# EAGLE board ccnor_stm32_v24-sync-unified-ss (EAGLE 6.1)
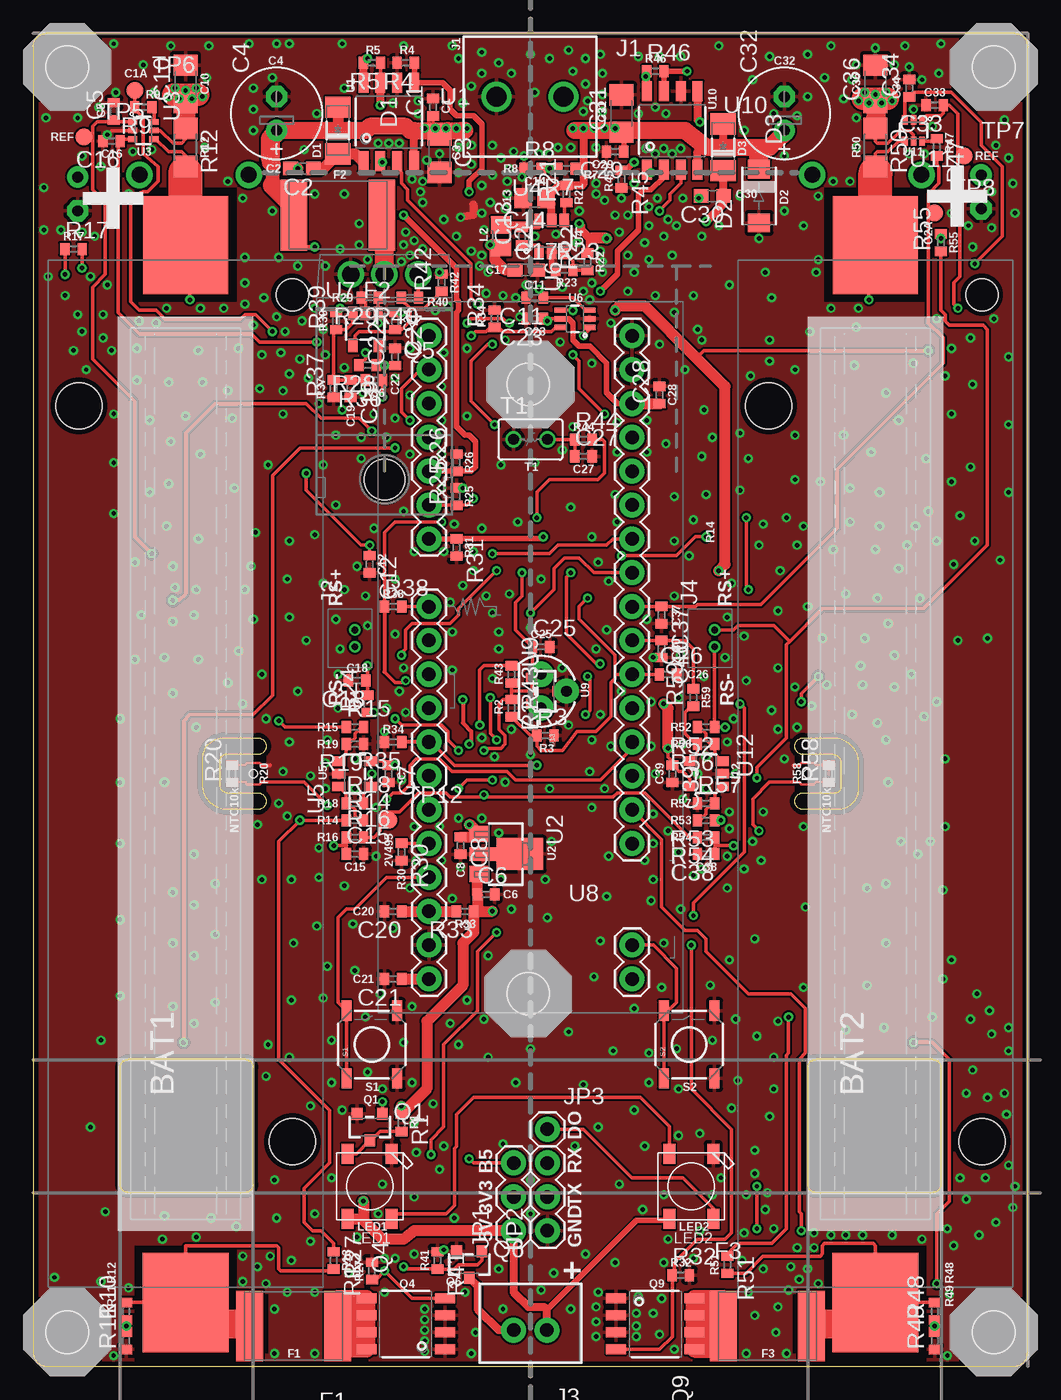
[diagram p2: board, top side]
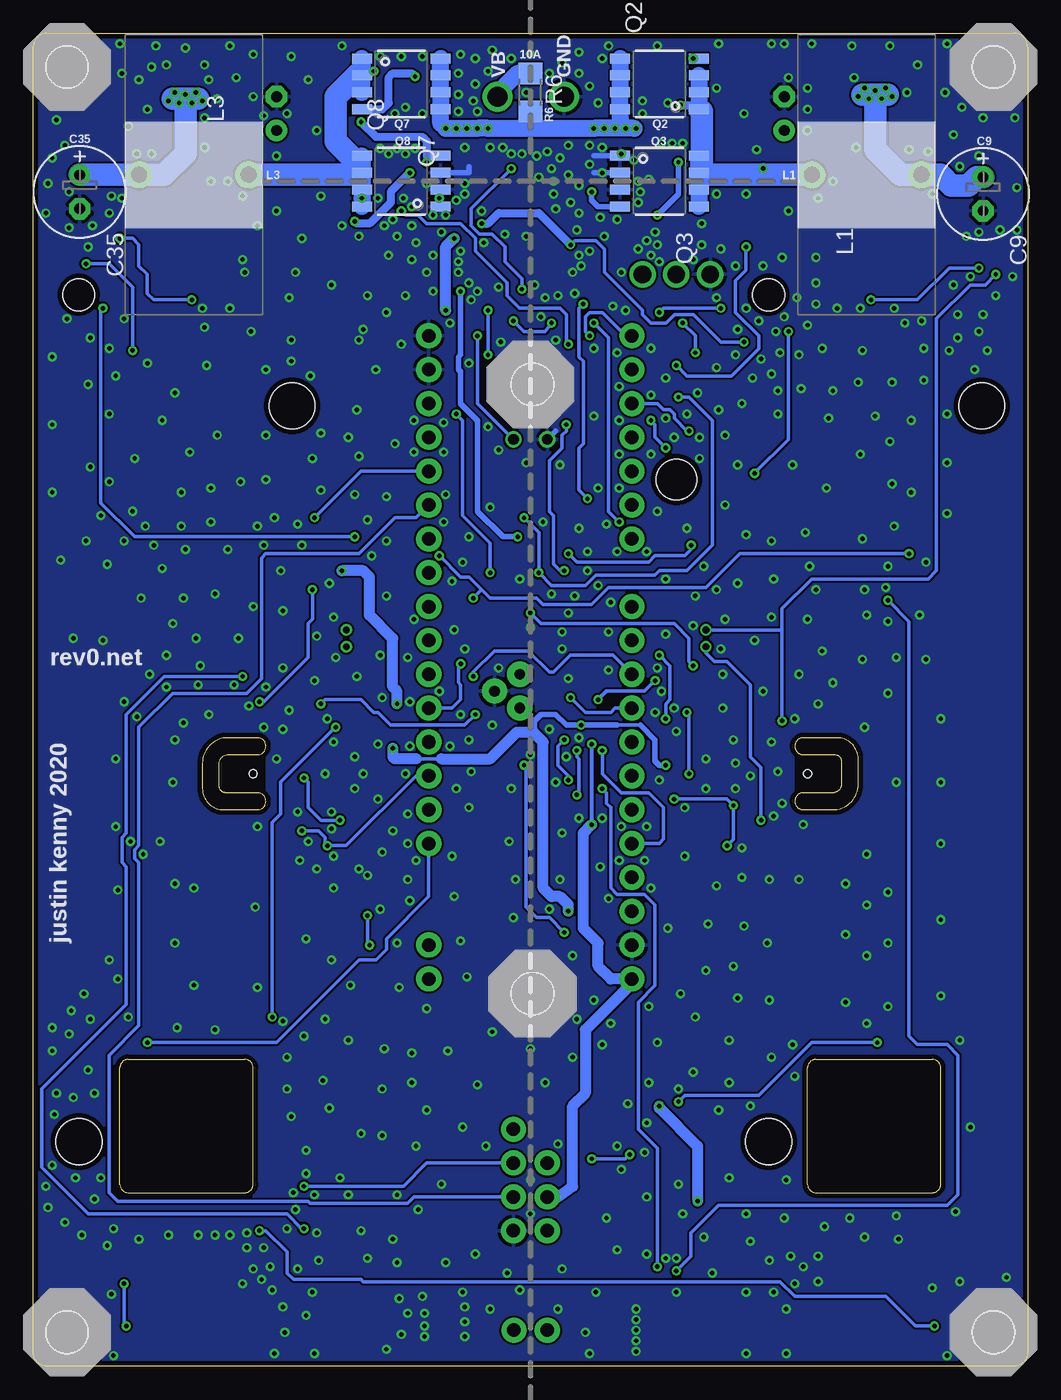
[diagram p3: board, bottom side, seen from below]

Size 74.6 x 100 mm. Coordinates in mm from the lower left corner, seen from the top.
Outline: 1,0 73.6,0 arc90 74.6,1 74.6,99 arc90 73.6,100 1,100 arc90 0,99 0,1 arc90 1,0
Outline: 57.78,43.02 60.17,43.02 arc90 60.64,43.5 60.64,45.24 arc90 60.01,45.88 57.78,45.88 arc-180 57.78,47.15 60.01,47.15 arc-90 61.91,45.24 61.91,43.34 arc-90 60.33,41.75 57.78,41.75 arc-180 57.78,43.02
Outline: 16.83,45.88 14.45,45.88 arc90 13.97,45.4 13.97,43.66 arc90 14.61,43.02 16.83,43.02 arc-180 16.83,41.75 14.61,41.75 arc-90 12.7,43.66 12.7,45.56 arc-90 14.29,47.15 16.83,47.15 arc-180 16.83,45.88
Outline: 6.51,13.65 6.51,22.38 arc-90 7.14,23.02 15.88,23.02 arc-90 16.51,22.38 16.51,13.65 arc-90 15.88,13.02 7.14,13.02 arc-90 6.51,13.65
Outline: 58.1,13.65 58.1,22.38 arc-90 58.74,23.02 67.47,23.02 arc-90 68.1,22.38 68.1,13.65 arc-90 67.47,13.02 58.74,13.02 arc-90 58.1,13.65
Copper layers (1*16): Top 0.0356mm / dielectric 1.5011mm / Bottom 0.0356mm
Design rules: minimum track width 6mil, minimum drill 13mil, track to track 6mil, track to pad 6mil, pad to pad 6mil, via to via 6mil, smd to smd 6mil, copper to edge 15mil, drill to drill 6mil, minimum pad ring 7mil, minimum via ring 7mil, stop-mask expansion 2.5mil, vias tented up to drill 14mil, thermal gap 10mil
Holes 3.17 mm at 2.54,2.54 72.07,2.54 72.07,97.47 37.15,73.66 37.15,27.94 2.54,97.47
Holes 3.05 mm at 26.35,66.52
Holes 0.6 mm at 16.51,44.45 58.1,44.45
tRestrict: area -0.6,94.3 to 5.7,100.6; area 68.9,94.3 to 75.2,100.6; area -0.6,-0.6 to 5.7,5.7; area 68.9,-0.6 to 75.2,5.7; area 34,24.8 to 40.3,31.1; area 34.1,70.5 to 40.5,76.8; area 57.1,42.5 to 59.1,46.4; area 14,43 to 17.5,45.7; area 59.4,0.5 to 67,9; area 57,1 to 59.4,5.4; area 7.6,0.5 to 15.2,9; area 15.2,1 to 17.6,5.4; 2 more areas
bRestrict: area 57.1,42.5 to 61,46.4; area 14,42.5 to 17.5,46.4; area -0.6,-0.6 to 5.7,5.7; area 68.9,-0.6 to 75.2,5.7; area 68.9,94.3 to 75.2,100.6; area -0.6,94.3 to 5.7,100.6; area 34.1,70.5 to 40.5,76.8; area 34,24.8 to 40.3,31.1

## Footprints (pad centres in the part's own frame; a part is rotated, then mirrored left to right if it is on the bottom)
1S_18650_SMD_NH = smd 7.341 x 6.35: 1+ 39.67,0 | smd 7.46 x 6.47: 1- -39.67,0 | hole 3.454: -27.6,-8; 27.6,8 | hole 2.39: 35.93,-8
C0402 = smd 0.7 x 0.9: 1 -0.65,0; 2 0.65,0
C0603 = smd 1.1 x 1: 1 -0.85,0; 2 0.85,0
C1206 = smd 1.6 x 1.8: 1 -1.4,0; 2 1.4,0
E2,5-7 = drill 0.813 pad 1.6: + -1.27,0 | drill 0.813 pad 1.6 octagon: - 1.27,0
C0805 = smd 1.3 x 1.5: 1 -0.85,0; 2 0.85,0
SOD123 = smd 1.6 x 1.9: A -1.75,0; K 1.75,0
SMA = smd 1.4 x 1.64: A -2.015,0; K 2.015,0
2920 = smd 2 x 5.3: A -3.3,0; K 3.3,0
PHOENIXCONTACT1935161 = drill 1.5: 1 0,0; 2 5,0
M02_1P25MM = drill 0.5: 1 -0.625,0; 2 0.625,0
B2B-XH-A = drill 1.016 pad 1.88: 1 -2.5,0; 2 0,0
1X03 = drill 1.016 pad 1.88: 1 0,0; 2 2.54,0; 3 5.08,0
1X01 = drill 1.016 pad 1.88: 1 0,0
INDUCTOR_10A_8.2MMX21MM = drill 1.2 pad 2: P$1 0,4.1; P$2 0,-4.1
0805 = smd 1.3 x 1.5: 1 -0.85,0; 2 0.85,0
WS2812B = smd 1.5 x 0.9: 1-VDD 2.45,-1.65; 2-DOUT 2.45,1.65; 3-GND -2.45,1.65; 4-DIN -2.45,-1.65
SOT23 = smd 0.8 x 0.9: 1 0.95,1; 2 -0.95,1; 3 0,-1
8-SOIC = smd 0.75 x 1.5: 1 -1.905,-2.95; 2 -0.635,-2.95; 3 0.635,-2.95; 4 1.905,-2.95; 5 1.905,2.95; 6 0.635,2.95; 7 -0.635,2.95; 8 -1.905,2.95
TO-220 = drill 1.325: 1 -2.54,0; 2 0,0; 3 2.54,0
R0402 = smd 0.7 x 0.9: 1 -0.65,0; 2 0.65,0
R1206 = smd 1.6 x 1.803: 1 -1.422,0; 2 1.422,0
TACTILE_SWITCH_SMD = smd 1.524 x 0.762: 1 -2.54,1.905; 2 2.54,1.905; 3 -2.54,-1.905; 4 2.54,-1.905
THERMISTOR_3MMX3MM = drill 0.813: 1 -1.27,0; 2 1.27,0
TPAD_MED_ROUND = smd 1.27 x 1.27: 1 0,0
SOT-89 = smd 1.2 x 1.5: 1 -1.5,0; 3 1.5,0 | smd 1 x 2: 2 0,0.25 | smd 2.4 x 3.5: 2@1 0,3
SOT-363 = smd 0.42 x 0.7: 1 -0.65,-0.8; 2 0,-0.8; 3 0.65,-0.8; 4 0.65,0.8; 5 0,0.8; 6 -0.65,0.8
SOT23-6 = smd 0.7 x 1: 1 -0.95,-1.2; 2 0,-1.2; 3 0.95,-1.2; 4 0.95,1.2; 5 0,1.2; 6 -0.95,1.2
SOT23-5 = smd 0.7 x 1: 1 0.95,1.2; 2 0,1.2; 3 -0.95,1.2; 4 -0.95,-1.2; 5 0.95,-1.2
SC70-6 = smd 0.4 x 0.9: 1 -0.65,-1.1; 2 0,-1.1; 3 0.65,-1.1; 4 0.65,1.1; 5 0,1.1; 6 -0.65,1.1
STM32_BLUE_PILL_USABLE = drill 1.016 pad 1.88: 3V3 -7.62,-19.05; 3V3_2 7.62,24.13; 5V 7.62,19.05; A0 -7.62,13.97; A1 -7.62,11.43; A2 -7.62,8.89; A3 -7.62,6.35; A4 -7.62,3.81; A5 -7.62,1.27; A6 -7.62,-1.27; A7 -7.62,-3.81; A8 7.62,-13.97; A9 7.62,-11.43; A10 7.62,-8.89; A12 7.62,-3.81; A15 7.62,-1.27; B0 -7.62,-6.35; B1 -7.62,-8.89; B3 7.62,1.27; B4 7.62,3.81; B5 7.62,6.35; B6 7.62,8.89; B7 7.62,11.43; B8 7.62,13.97; B9 7.62,16.51; B10 -7.62,-11.43; B11 -7.62,-13.97; B12 7.62,-24.13; B13 7.62,-21.59; B14 7.62,-19.05; B15 7.62,-16.51; C13 -7.62,21.59; GND -7.62,-24.13; GND2 -7.62,-21.59; GND4 7.62,21.59; RST -7.62,-16.51; VBAT -7.62,24.13
TO-92 = drill 0.813 pad 1.88: 1 -1.27,0; 2 0,1.905; 3 1.27,0

## Placement (x,y rotation side)
BAT1  1_18650_HOLDER  [1S_18650_SMD_NH]  11.43,44.45 90 top
BAT2  1_18650_HOLDER  [1S_18650_SMD_NH]  63.18,44.45 90 top
C1  1u  [C0402]  30,94.46 90 top
C2  1u  [C0603]  20.16,89.85 180 top
C3  10u  [C1206]  30.48,90.96 270 top
C4  470u  [E2,5-7]  18.26,93.98 90 top
C5  1u  [C0402]  6.03,94.14 90 top
C6  1u  [C0402]  33.97,35.4 0 top
C7  1u  [C0402]  26.67,44.45 270 top
C8  1u  [C0402]  32.07,39.05 270 top
C9  470u  [E2,5-7]  3.33,87.95 270 bottom
C10  10u  [C1206]  11.43,96.2 90 top
C11  1u  [C0402]  37.62,80.17 180 top
C12  100n  [C0402]  25.24,60.17 270 top
C13  100n  [C0402]  36.67,84.77 90 top
C14  22u  [C0805]  37.62,87.63 180 top
C15  1u  [C0402]  24.13,38.42 0 top
C16  1u  [C0402]  5.87,91.92 180 top
C17  22u  [C0603]  36.99,82.23 0 top
C18  100n  [C0402]  24.29,51.44 180 top
C19  100n  [C0402]  23.81,73.34 270 top
C20  1u  [C0402]  26.99,34.13 180 top
C21  1u  [C0402]  26.99,29.05 180 top
C22  1u  [C0402]  27.15,75.72 90 top
C23  1u  [C0402]  37.62,78.58 180 top
C24  DNI  [C0402]  27.15,78.42 270 top
C25  1u  [C0402]  38.1,53.98 0 top
C26  4.7u  [C0402]  47.62,51.91 0 top
C27  1u  [C0402]  41.27,68.26 0 top
C28  1u  [C0402]  46.99,72.87 90 top
C29  1u  [C0402]  43.66,91.12 180 top
C30  1u  [C0603]  50.96,87.79 180 top
C31  10u  [C1206]  44.13,93.98 90 top
C32  470u  [E2,5-7]  56.36,93.98 90 top
C33  1u  [C0402]  67.63,94.61 180 top
C34  1u  [C0402]  65.72,95.89 90 top
C35  470u  [E2,5-7]  71.12,88.11 270 bottom
C36  10u  [C1206]  63.18,96.2 90 top
C37  100n  [C0402]  47.15,56.36 270 top
C38  1u  [C0402]  50.48,38.42 180 top
C39  1u  [C0402]  47.94,44.45 270 top
C40  100n  [C0402]  47.15,53.82 270 top
D1  SS16F  [SOD123]  22.86,92.71 270 top
D2  SS54  [SMA]  54.45,87.79 90 top
D3  SS16F  [SOD123]  51.75,91.44 270 top
F1  PTC2920  [2920]  19.53,3.02 180 top
F2  PTC2920  [2920]  22.86,86.36 180 top
F3  PTC2920  [2920]  55.09,3.02 0 top
J1  M02PT  [PHOENIXCONTACT1935161]  34.77,95.25 0 top
J2  M021P25  [M02_1P25MM]  24.13,54.61 90 top
J3  M02XH  [B2B-XH-A]  36.04,2.7 180 top
J4  M021P25  [M02_1P25MM]  51.12,54.61 90 top
JP1  [1X03]  36.04,10.16 90 top
JP2  [1X03]  38.58,10.16 90 top
JP3  M01PTH  [1X01]  38.58,17.78 0 top
L1  60u  [INDUCTOR_10A_8.2MMX21MM]  12.06,89.38 90 bottom
L2  4.7u  [0805]  35.08,84.77 270 top
L3  60u  [INDUCTOR_10A_8.2MMX21MM]  62.55,89.38 270 bottom
LED1  WS2812B  [WS2812B]  25.24,13.49 270 top
LED2  WS2812B  [WS2812B]  49.37,13.49 270 top
Q1  2N7002P  [SOT23]  25.24,17.94 0 top
Q2  WSP4406  [8-SOIC]  27.62,96.2 90 bottom
Q3  WSP4406  [8-SOIC]  27.62,88.9 270 bottom
Q4  NCE3018AS  [8-SOIC]  27.94,3.17 90 top
Q5  IRLB8314PBF  [TO-220]  26.35,81.92 180 top
Q6  2302  [SOT23]  32.7,7.62 0 top
Q7  WSP4406  [8-SOIC]  46.99,96.2 270 bottom
Q8  WSP4406  [8-SOIC]  46.99,88.9 90 bottom
Q9  NCE3018AS  [8-SOIC]  46.67,3.17 270 top
R1  680  [R0402]  27.62,18.26 270 top
R2  820  [R0402]  35.88,49.37 270 top
R3  1.6k  [R0402]  38.42,47.31 0 top
R4  10k  [R0402]  27.94,97.79 180 top
R5  10k  [R0402]  25.4,97.79 180 top
R6  5A  [R1206]  37.31,95.57 270 bottom
R7  30k  [R0402]  40.01,89.85 180 top
R8  10k  [R0402]  37.47,89.85 0 top
R9  1.6k  [R0402]  8.26,94.46 180 top
R10  10k  [R0402]  6.99,4.13 90 top
R11  10k  [R0402]  6.99,1.91 90 top
R12  5m  [R1206]  11.43,91.44 270 top
R13  100  [R0402]  22.54,7.94 270 top
R14  220k  [R0402]  24.13,40.96 0 top
R15  220k  [R0402]  24.13,47.94 0 top
R16  10k  [R0402]  24.13,39.69 0 top
R17  100  [R0402]  3.02,83.82 0 top
R18  150k  [R0402]  24.13,42.23 0 top
R19  150k  [R0402]  24.13,46.67 180 top
R20  NTC 10k  [R0402]  14.92,44.45 90 top
R21  150k  [R0402]  40.01,87.95 90 top
R22  51k  [R0402]  41.59,82.87 90 top
R23  10k  [R0402]  39.85,82.23 0 top
R24  1.6k  [R0402]  25.08,49.69 90 top
R25  10k  [R0402]  31.75,65.25 90 top
R26  10k  [R0402]  31.75,67.79 90 top
R27  10k  [R0402]  25.4,7.14 90 top
R28  68k  [R0402]  25.08,75.09 180 top
R29  13k  [R0402]  25.24,80.17 180 top
R30  10k  [R0402]  27.62,38.58 270 top
R31  10k  [R0402]  31.75,61.44 270 top
R32  10k  [R0402]  48.58,6.83 0 top
R33  10  [R0402]  32.38,34.13 180 top
R34  10k  [R0402]  34.61,78.58 90 top
R35  10k  [R0402]  26.99,46.83 180 top
R36  2.4k  [R0402]  25.56,73.98 180 top
R37  10k  [R0402]  22.54,73.34 90 top
R38  1.6k  [R0402]  26.99,56.99 0 top
R39  DNI  [R0402]  22.7,78.42 90 top
R40  680  [R0402]  28.26,80.17 180 top
R41  10k  [R0402]  30.32,7.94 270 top
R42  DNI  [R0402]  30.64,81.28 90 top
R43  120  [R0402]  35.88,51.91 270 top
R44  10k  [R0402]  41.27,69.53 0 top
R45  10k  [R0402]  44.13,89.06 270 top
R46  10k  [R0402]  46.67,97.16 0 top
R47  1.6k  [R0402]  67.79,91.44 270 top
R48  10k  [R0402]  67.63,4.13 90 top
R49  10k  [R0402]  67.63,1.91 90 top
R50  5m  [R1206]  63.18,91.44 270 top
R51  100  [R0402]  52.07,7.62 270 top
R52  220k  [R0402]  50.48,47.94 180 top
R53  220k  [R0402]  50.48,40.96 180 top
R54  10k  [R0402]  50.48,39.69 180 top
R55  100  [R0402]  68.1,84.3 90 top
R56  150k  [R0402]  50.48,46.67 180 top
R57  150k  [R0402]  50.48,42.23 0 top
R58  NTC 10k  [R0402]  59.69,44.45 90 top
R59  1.6k  [R0402]  49.53,50.16 90 top
S1  [TACTILE_SWITCH_SMD]  25.4,24.13 90 top
S2  [TACTILE_SWITCH_SMD]  49.21,24.13 90 top
T1  NTC3MM  [THERMISTOR_3MMX3MM]  37.31,69.53 0 top
TP5  TPADMED_ROUND  [TPAD_MED_ROUND]  3.81,92.23 0 top
TP6  TPADMED_ROUND  [TPAD_MED_ROUND]  7.62,95.73 0 top
TP7  TPADMED_ROUND  [TPAD_MED_ROUND]  69.85,90.81 0 top
TP8  TPADMED_ROUND  [TPAD_MED_ROUND]  67.63,86.52 0 top
TP12  TPADMED_ROUND  [TPAD_MED_ROUND]  26.67,40.96 0 top
U1  ADP3110A  [8-SOIC]  26.67,93.34 0 top
U2  3.3V  [SOT-89]  33.5,38.42 270 top
U3  NCS199A1  [SOT-363]  8.26,92.71 270 top
U4  MP2359  [SOT23-6]  38.89,84.77 0 top
U5  MCP6001U  [SOT23-5]  24.13,44.45 90 top
U6  SN74LVC1G3157SC70-6  [SC70-6]  40.64,78.58 90 top
U7  LM321  [SOT23-5]  24.92,77.79 0 top
U8  STM32_BLUE_PILL  [STM32_BLUE_PILL_USABLE]  37.31,53.18 180 top
U9  TL431SOT23  [SOT23]  38.42,50.64 90 top
U10  ADP3110A  [8-SOIC]  47.94,92.71 0 top
U11  NCS199A1  [SOT-363]  66.04,92.71 180 top
U12  MCP6001U  [SOT23-5]  50.48,44.45 270 top
U13  TL431TO92  [TO-92]  38.1,50.64 270 top

## Tracks (layer width: path | path; a pad name or v marks a point on that pad's centre or on a via)
2V495  (via drill 0.33)
  Top 0.254: U9.1 37.42,51.79 | U9.2 37.47,49.64 37.47,49.58 37.42,49.53 | 35.88,50.64 R2.1 35.26,50.02 34.92,49.69 34.92,47.78 35.4,47.31 35.4,46.67 35.08,46.35 33.97,46.35 v33.81,46.2 | U9.1 37.42,50.64 | 37.42,50.64 U9.2 | U9.2 37.42,49.53 | 37.42,49.53 37.42,49.49 | R43.2 35.88,50.64 | 35.88,50.64 37.42,50.64 | R44.2 42.7,69.53 42.86,69.37 42.86,66.99 42.39,66.52 38.73,66.52 37.78,65.56 v37.78,63.66 | v36.67,59.53 36.67,57.78 36.2,57.31 36.2,55.23 C25.1 37.47,53.96 37.47,51.64 | R16.2 25.56,39.69 26.04,40.16 26.04,41.27 26.35,41.59 26.67,41.59 | 26.67,41.59 27.46,41.59 28.89,43.02 30.96,43.02 31.27,42.7 33.66,42.7 v33.81,42.86 33.97,42.7 43.5,42.7 43.81,43.02 45.88,43.02 49.21,39.69 R54.2 49.85,39.69 | R36.1 26.21,72.72 v26.19,72.71 | TP12.1 26.67,41.59 | U13.3 37.74,49.37 U9.2 | U13.1 37.74,51.91 37.47,51.64 | 37.47,51.64 U9.1
  Bottom 0.254: v37.78,63.66 36.67,62.55 v36.67,59.53 35.72,58.58 33.18,58.58 32.38,59.37 27.94,59.37 27.62,59.69 25.56,59.69 23.65,61.59 23.65,70.96 25.4,72.71 v26.19,72.71 | v33.81,42.86 33.66,43.18 33.66,45.56 33.81,45.72 v33.81,46.2
3V3  (via drill 0.33)
  Top 0.254: R38.1 26.34,62.53 27.15,63.34 v30.64,63.34 | v32.54,78.26 32.86,78.58 35.24,78.58 35.56,78.26 v35.72,78.26 | U6.5 38.73,78.58 v38.58,78.42 38.42,78.58 C23.1 | 26.34,52.09 27.15,51.28 27.78,51.28 v27.94,51.44
  Top 0.305: R38.1 26.34,52.09 | v32.23,50.01 32.23,48.26 32.86,47.62 32.86,46.83 v32.7,46.67
  Top 0.406: U6.5 40.16,78.58 40.48,78.26 40.48,76.99 40.96,76.52 41.75,76.52 43.02,75.25 43.02,73.03 43.81,72.23 U8.3V3
  Top 0.813: U8.3V3 C28.1 | C21.1 U8.3V3_2 | v32.7,40.64 32.77,40.64 U2.1 33.28,39.7 C8.1
  Bottom 0.254: v32.54,78.26 31.43,77.15 31.43,64.14 v30.64,63.34 | v35.72,78.26 36.2,77.63 37.78,77.63 v38.58,78.42 | 31.59,50.64 28.73,50.64 v27.94,51.44
  Bottom 0.305: 31.59,50.64 v32.23,50.01 | v32.7,46.67 v32.7,40.64
  Bottom 0.813: JP1.2 35.24,12.7 34.13,13.49 34.13,19.53 33.18,20.48 33.18,25.24 29.69,28.73 U8.3V3_2 31.27,29.05 32.23,30 32.23,31.75 33.34,32.86 33.34,40.01 v32.7,40.64
5V  (via drill 0.33)
  Top 0.254: R43.1 33.83,52.56 33.5,52.23 v33.5,48.1 | v21.27,76.83 16.99,76.83 16.35,77.47 7.94,77.47 6.35,79.06 6.35,91.76 C16.1 6.67,92.06 U3.3 | U11.3 65.39,94.9 C34.1 65.72,95.25 66.04,95.57 68.9,95.57 71.12,93.34 71.12,91.6 72.71,90.01 72.71,84.77 v70.64,82.71 | v67.15,76.2 50.32,76.2 49.85,75.72 49.69,75.72 | R22.2 41.59,84.77 41.27,85.09 | U5.5 26.37,45.4 C7.1 27.13,45.1 v27.15,45.09 26.67,45.09 | U12.5 49.28,44.06 48.74,44.61 48.43,44.61 C39.1 47.94,45.4 47.62,45.72 v47.62,46.35 | 34.61,83.82 34.98,83.82 L2.2 | 41.81,84.61 42.27,84.61 42.17,84.72
  Top 0.406: 47.63,10.95 45.24,10.95 38.54,4.25
  Top 0.61: J3.1 38.54,4.25 38.34,4.45 37.15,4.45 36.04,5.56 JP1.1 | 36.02,82.11 C17.1 | 42.17,84.72 41.65,84.72 41.27,85.09 41.12,85.25 41.12,85.57 v40.96,85.72
  Top 0.813: R33.1 33.03,32.56 32.23,31.75 32.23,28.57 29.53,25.88 29.53,20.81 R1.1 27.64,18.91 v27.62,19.53 | 47.63,10.95 LED2.1-VDD | JP1.1 28.57,10.16 27.78,9.53 26.19,9.53 24.68,11.04 | LED1.1-VDD 24.68,11.04 | v24.77,12.38 24.77,11.13 24.68,11.04 | v43.66,79.22 43.97,79.53 45.88,79.53 49.69,75.72 51.91,73.5 51.91,60.17 v51.44,59.69 | v43.02,84.61 41.81,84.61 | R33.1 33.32,34.42 C6.1 33.32,36.74 U2.3 | R33.1 v34.45,34.13 | v47.62,46.35 47.62,49.37 v47.31,49.69 | v34.29,84.14 34.61,83.82 34.61,83.03 35.4,82.23 C17.1
  Bottom 0.254: 45.88,45.56 43.97,45.56 | 30.8,48.1 29.05,48.1 | v67.15,76.2 67.15,80.96 68.9,82.71 v70.64,82.71 | 27.32,45.09 v27.15,45.09 | v21.27,76.83 23.02,76.83 25.08,78.9 26.51,78.9 27.15,78.26 28.26,78.26 28.89,78.9 28.89,79.22 31.75,82.07 31.75,83.82 32.38,84.45 33.97,84.45 v34.29,84.14
  Bottom 0.406: 27.32,45.09 27.62,45.09 27.94,45.4 27.94,46.99 29.05,48.1 | 30.8,48.1 v33.5,48.1 34.61,48.1 35.4,48.9 36.51,48.9 36.99,48.42 36.99,47.78 37.07,47.7 37.07,47.55
  Bottom 0.61: v40.96,85.72 40.48,85.72 39.69,86.52 36.67,86.52 v34.29,84.14
  Bottom 0.813: 43.97,45.56 40.32,45.56 38.34,47.55 37.07,47.55 36.35,46.83 36.35,35.88 35.72,35.24 35.08,35.24 34.45,34.61 v34.45,34.13 | v27.62,19.53 27.62,19.37 24.77,16.51 v24.77,12.38 | v43.66,79.22 43.66,83.98 v43.02,84.61 | v47.62,46.35 47.62,45.72 47.47,45.56 45.88,45.56 | v47.31,49.69 47.31,50.64 47.62,50.96 47.62,54.61 49.37,56.36 49.37,59.21 49.85,59.69 v51.44,59.69
5V_USB
  Top 0.813: C20.1 U8.5V R33.2
7V4  (via drill 0.33)
  Top 0.254: v30.16,92.87 v29.37,92.87 C1.1 30,92.71 v30.16,92.87 | v30.16,92.87 v30.96,92.87 | v30.96,92.87 31.11,92.71 | v30.96,92.87 v31.75,92.87 | 32.07,92.71 31.75,93.03 32.2,93.03 32.38,93 v32.54,92.87 C3.1 | 41.59,92.55 v43.66,92.87 | 47.32,93.01 47.29,93.01 47.15,92.87 | 45.09,92.71 45.24,92.87 45.88,92.87 45.55,93.2 | 40.64,92.71 v40.48,92.87 | 22.7,94.77 22.84,94.63 | 22.84,94.76 22.84,94.63 | 22.84,94.63 22.86,94.61 | R28.1 v26.35,75.09 26.04,75.09 | 26.04,75.09 C22.1 26.19,75.09 | U7.5 25.87,76.36 26.04,76.2 26.04,75.09 | F2.K 19.56,84.74 20.32,83.98 v21.11,83.98 | 44.31,92.85 44.31,92.75 C31.1
  Top 0.406: 47.32,93.01 47.62,92.71 | 22.86,94.61 D1.A | C29.1 44.31,92.85 45.09,92.71
  Top 0.61: 41.32,89.85 41.32,88.74 41.17,88.6 R21.2 39.44,88.6 C14.1 38.89,87.21 U4.5 | 41.32,89.85 41.32,92.35 41.59,92.55 | R7.1 41.32,89.85 | U1.4 28.57,92.71 | U10.4 49.85,91.12 50.16,91.44 50.48,91.44 | D3.A 51.75,91.76 52.07,91.44
  Top 0.813: D1.A 22.86,92.71 | 56.38,92.53 56.38,92.69 C32.+
  Top 1.016: 17.94,90.17 17.94,88.74
  Top 1.27: 32.38,92.71 32.07,92.71 31.11,92.71 28.57,92.71 28.26,92.71 27.94,93.03 25.24,93.03 24.92,92.71 22.86,92.71 C4.+ | 40.64,92.71 45.09,92.71 47.62,92.71 48.9,92.71 50.48,91.44 52.07,91.44 54.45,91.44 | 56.38,92.53 55.24,91.44 54.45,91.44 | 17.78,90.65 17.78,90.33 17.94,90.17 | 17.94,88.74 17.94,88.58 | 54.29,91.28 54.45,91.44
  Top 1.422: C4.+ 18.26,92.55 17.78,92.08 17.78,90.65 | 17.94,88.58 19.56,86.96 F2.K | D2.K 54.45,91.12 54.29,91.28
  Bottom 0.254: v41.27,92.87 34.92,92.71 | v43.66,92.87 41.91,92.71 | 36.83,92.71 37.46,92.74 v40.48,92.87 | 30.48,93.34 29.53,92.87 v29.37,92.87 | v21.11,83.98 21.11,82.23 21.91,81.44 21.91,79.06 20.16,77.31 20.16,76.36 22.23,74.3 25.56,74.3 v26.35,75.09 | v32.54,92.87 32.52,92.87 | 43.79,93 v43.66,92.87 | 44.04,93.25 v43.66,92.87
  Bottom 0.406: 30.64,98.17 Q2.5
  Bottom 1.016: v42.86,92.87 37.31,93.03 | 37.31,93.03 R6.2 | 37.47,92.87 37.31,93.03
  Bottom 1.27: 29.53,92.87 32.52,92.87 v40.48,92.87 | v43.66,92.87 v42.86,92.87 v42.07,92.87 v41.27,92.87 v40.48,92.87 | v40.48,92.87 37.47,92.87 | 30.48,93.34 30.57,93.44 Q2.8 Q2.7 Q2.6 Q2.5 | 44.04,93.25 Q7.5 Q7.6 Q7.7 Q7.8
7V4_SNS  (via drill 0.33)
  Top 0.254: R7.2 v38.73,89.85 R8.2 | U6.3 41.45,79.23 40.51,80.17 C11.1 38.27,80.47 v37.94,80.8
  Bottom 0.254: v38.73,89.85 41.75,86.84 41.75,85.57 41.12,84.93 40.16,84.93 39.21,83.98 39.21,82.87 37.94,81.6 v37.94,80.8
AUX_SNS  (via drill 0.33)
  Top 0.254: v40.32,59.53 40.01,59.21 40.01,54.93 42.21,52.72 42.52,52.72 v42.53,52.7 42.23,52.7 | v42.86,71.44 40.96,73.34 40.96,75.41 v40.48,75.88 | U6.4 40.47,79.23 v40.48,79.22
  Bottom 0.254: U8.A4 43.18,49.37 42.55,50.01 42.55,51.12 42.7,51.28 42.7,52.55 42.55,52.7 v42.53,52.7 | v40.32,59.53 40.32,61.75 42.39,63.82 42.39,70.96 v42.86,71.44 | v40.48,75.88 v40.48,79.22
BST
  Top 0.813: C2.1 21.75,89.85 D1.K 24.13,90.96 24.7,90.39 U1.1
BST2  (via drill 0.33)
  Top 0.61: D3.K 51.75,88 C30.1 51.75,87.84 | U10.1 46.13,89.76 v46.35,89.53 | v50.48,85.88 51.75,87.15 51.75,87.84 | 51.75,87.95 51.75,87.84
  Bottom 0.61: v46.35,89.53 47.78,88.11 47.78,87.31 49.37,85.72 50.32,85.72 v50.48,85.88
BST5V
  Top 0.254: U4.1 37.94,83.66 37.94,84.14 C13.1
C1+  (via drill 0.33)
  Top 0.254: U3.4 9.19,92.06 10.16,91.12 11.11,91.12 11.43,90.81 R12.2 | v11.75,80.01 11.75,83.5 11.43,83.82 BAT1.1+ | R17.2 3.67,82.41 v3.65,82.39
  Top 1.422: 11.43,89.53 R12.2
  Top 2.54: BAT1.1+ 11.43,89.53
  Bottom 0.254: v11.75,80.01 8.26,80.01 5.87,82.39 v3.65,82.39
C1-
  Top 0.254: BAT1.1- 11.1,4.45 10.79,4.45 10.46,4.78 R10.2 | 12.05,4.78 12.05,7 11.43,7.62 11.43,9.05 18.26,9.05 18.41,8.89 18.41,7.3 18.57,7.14 22.23,7.14 22.37,7.29 R13.2
  Top 1.27: 15.56,3.17 F1.K
  Top 2.184: BAT1.1- 12.05,4.78 13.65,3.17 15.56,3.17
C1A  (via drill 0.33)
  Top 0.254: v17.94,77.63 16.67,78.9 15.88,78.9 15.56,78.58 9.84,78.58 9.21,79.22 7.94,79.22 7.3,79.85 7.3,87.15 7.78,87.63 7.78,87.95 8.26,88.11 8.57,88.11 9.37,88.9 9.37,90.01 8.26,90.96 8.26,93.66 7.61,94.31 R9.2 7.62,94.47 TP6.1 | v20.48,66.99 20.48,65.72 24.61,61.59 v25.24,61.59 C12.1 | U8.B1 43.5,62.07 43.02,61.59 39.37,61.59 38.73,60.96 v34.45,60.96
  Bottom 0.254: v17.94,77.63 17.94,69.53 v20.48,66.99 | v34.45,60.96 33.81,60.33 28.42,60.33 27.94,60.8 25.72,60.8 25.24,61.28 v25.24,61.59
C1COFF  (via drill 0.33)
  Top 0.254: v33.02,65.09 32.53,64.6 R25.1 31.75,64.77 31.59,64.61 U8.A9 | v33.34,79.69 32.86,80.17 32.86,82.71 28.1,87.47 28.1,88.27 27.62,88.74 27.62,89.53 27.46,89.69 27.46,90.17 27.3,90.33 U1.3
  Bottom 0.254: v33.02,65.09 33.66,65.72 33.66,68.9 33.34,69.22 33.34,75.41 33.66,75.72 33.66,79.38 v33.34,79.69
C1FET  (via drill 0.33)
  Top 0.406: v27.78,86.36 31.75,82.39 31.75,80.01 31.91,79.85 31.91,79.22 31.75,79.06 31.75,70.48 32.38,69.85 32.7,69.85 33.18,69.37 33.18,67.47 32.86,67.15 31.77,67.15 R26.1 31.73,67.15 31.59,67.15 | U8.A8 31.59,67.15 | 31.59,67.15 31.75,67.31 | U1.2 26.13,90.39 v26.19,90.33
  Bottom 0.406: v26.19,90.33 26.19,87.95 v27.78,86.36
C1N  (via drill 0.33)
  Top 0.254: R5.1 26.05,95.67 U1.7
  Top 0.61: U1.7 v26.04,94.61
  Top 0.813: C2.2 v19.84,89.85
  Bottom 0.61: v26.04,94.61 24.99,94.61 Q2.1 24.67,94.36
  Bottom 0.813: Q3.7 24.29,89.53 24.13,89.38 | L1.P$1 19.37,89.38 v19.84,89.85
  Bottom 1.27: Q3.8 Q3.7 Q3.6 Q3.5 | Q2.3 Q2.2 24.67,94.36 24.61,94.3
  Bottom 1.676: L1.P$1 24.13,89.38 24.29,89.38 24.45,89.53 24.45,94.14 24.61,94.3
C1ON  (via drill 0.33)
  Top 0.254: v10.48,57.47 10.95,57.47 11.43,57.94 11.43,70.01 13.65,72.23 20.48,72.23 21.59,71.12 24.45,71.12 v25.4,70.17 | R27.1 25.7,6.49 v26.35,7.14 28.42,5.08 Q4.4
  Bottom 0.254: v10.48,57.47 8.89,55.88 8.89,24.77 8.26,24.13 6.03,24.13 5.24,23.34 5.24,12.86 6.03,12.06 23.18,12.06 25.24,10 25.24,8.26 v26.35,7.14 | v25.4,70.17 25.56,70.17 26.51,71.12 26.51,71.44 26.83,71.75 27.3,71.75 27.78,72.23 U8.B14
C1R  (via drill 0.33)
  Top 0.254: R11.2 v6.99,3.02 R10.1 | U8.A1 47.15,39.53 47.15,34.45 48.9,32.7 49.85,32.7 50.48,32.07 50.48,31.11 53.66,27.94 56.83,27.94 57.94,26.83 57.94,23.5 57.47,23.02 57.47,11.59 57.63,11.43 v57.63,10.16
  Bottom 0.254: v6.99,3.02 8.41,3.02 10.64,5.24 17.46,5.24 18.57,6.35 49.85,6.35 50.01,6.51 55.09,6.51 55.56,6.99 55.56,8.57 57.15,10.16 v57.63,10.16
C1TH  (via drill 0.33)
  Top 0.203: 17.14,43.81 16.99,43.66 16.03,43.66 15.88,43.81 14.94,43.81 R20.1
  Top 0.254: 17.14,43.81 17.16,43.83 20.3,43.83 v22.07,42.07 | U8.A3 44.93,46.35 42.55,43.97 36.2,43.97 35.56,44.61 31.43,44.61 30.48,45.56 28.73,45.56 28.26,45.09 28.26,43.66 27.62,43.02 26.99,43.02 v26.51,42.55 | C15.1 R16.1 23.48,39.07 23.5,39.05 v22.54,39.05
  Bottom 0.254: v22.54,39.05 22.07,39.53 v22.07,42.07 22.54,42.55 v26.51,42.55
C1V  (via drill 0.33)
  Top 0.254: U8.B0 42.07,59.53 40.96,60.64 39.85,60.64 39.05,59.85 39.05,58.26 v37.31,56.52 | 25.1,51.26 25.09,51.44 | 25.09,51.44 v25.08,52.55 | R24.2 25.08,51.29 C18.1 25.09,51.44
  Bottom 0.254: v37.31,56.52 36.51,55.72 26.51,55.72 25.4,54.61 25.4,52.86 v25.08,52.55
C1V_OA  (via drill 0.33)
  Top 0.254: R18.2 24.78,42.95 U5.4 25.33,44.37 v25.4,44.44 | v25.56,49.05 25.1,49.05 R24.1
  Bottom 0.254: v25.4,44.44 25.4,48.9 v25.56,49.05
C1VFBN  (via drill 0.33)
  Top 0.254: R39.2 v23.02,79.38 | v27.62,79.06 27.16,79.06 C24.1
  Bottom 0.254: v23.02,79.38 27.3,79.38 v27.62,79.06
C2+  (via drill 0.33)
  Top 0.254: U11.4 64.94,91.91 64.14,91.12 63.34,91.12 63.18,90.96 R50.2 63.18,89.53 | BAT2.1+ 63.18,81.12 62.71,80.64 v62.71,80.01 | R55.2 v68.1,84.61
  Top 2.54: BAT2.1+ 63.18,89.53
  Bottom 0.254: v68.1,84.61 67.15,84.61 66.67,84.14 66.67,82.55 66.04,81.92 66.04,80.49 65.56,80.01 v62.71,80.01
C2-
  Top 0.254: F3.K 58.55,3.17 59.05,3.17 | R48.2 BAT2.1- 63.18,9.05 63.02,9.21 59.37,9.21 59.21,9.05 59.21,8.41 59.04,8.24 54.75,8.24 53.5,6.99 52.07,6.99 R51.2
  Top 2.184: 59.05,3.17 61.58,3.17 BAT2.1-
C2A
  Top 0.254: 67.15,86.36 67.15,87.95 67.94,88.74 67.94,90.01 67.79,90.17 R47.2 | 67.15,86.36 67.15,78.26 68.26,77.15 68.26,75.25 60.33,67.31 60.33,62.87 54.61,57.15 49.85,57.15 49.69,56.99 46.99,56.99 U8.A7 | TP8.1 67.31,86.52 67.15,86.36 | C37.1 46.99,57.01
  Top 0.406: 46.99,57.01 46.99,56.99
C2COFF  (via drill 0.33)
  Top 0.254: v31.91,46.2 31.11,46.99 31.11,47.62 30.64,48.1 27.62,48.1 v27.15,48.58 | v27.62,53.34 27.62,53.5 27.94,53.82 27.94,55.24 28.42,55.72 31.27,55.72 31.91,56.36 31.91,56.83 v34.77,59.69 | U10.3 48.58,88.74 47.78,87.95 47.78,87.47 v46.99,86.68 | v34.45,76.68 34.13,76.68 32.86,75.41 32.86,72.39 v34.61,70.64 | R30.1 29.67,39.23 U8.B8
  Bottom 0.254: v31.91,46.2 31.91,44.45 30.48,43.02 28.42,43.02 27.3,41.91 27.3,39.54 R30.1 29.67,39.23 U8.B8 | v27.15,48.58 27.15,49.69 26.83,50.01 26.83,52.55 v27.62,53.34 | v34.77,59.69 35.08,59.69 35.56,60.17 35.56,63.82 35.88,64.14 35.88,67.94 34.92,68.9 34.92,69.85 34.61,70.17 v34.61,70.64 | v46.99,86.68 46.67,86.36 45.72,86.36 45.09,85.72 42.55,85.72 41.43,84.61 41.43,83.66 39.05,81.28 39.05,80.33 38.1,79.38 35.08,79.38 34.61,78.9 34.61,76.83 v34.45,76.68
C2FET  (via drill 0.33)
  Top 0.406: U10.2 47.31,89.22 46.35,88.27 45.72,88.27 45.4,87.95 45.4,85.25 43.81,83.66 43.81,81.92 v42.55,80.64 | U8.A10 31.73,62.07 R31.1 38.12,62.09 v38.26,62.23
  Bottom 0.406: v38.26,62.23 39.37,62.23 41.27,64.14 41.27,70.96 42.55,72.23 42.55,74.61 42.7,74.77 42.7,75.72 42.55,75.88 v42.55,80.64
C2N  (via drill 0.33)
  Top 0.254: R46.2 47.62,97.16
  Top 0.406: U10.7 47.31,96.84 47.62,97.16 v49.05,97.16
  Top 0.61: C30.2 v49.94,87.63
  Bottom 0.406: Q7.2 49.37,96.84 v49.05,97.16
  Bottom 0.813: Q7.3 49.85,95.89 50.16,97 | Q8.6 50.64,89.53
  Bottom 1.27: Q8.5 Q8.6 Q8.7 v49.94,87.63 Q8.8 | Q7.1 Q7.2 | Q7.2 49.94,96.59 50.01,96.52 | Q7.3 Q7.2
  Bottom 1.676: L3.P$1 50.64,89.38 50.64,89.53 50.64,90.65 51.91,91.92 51.91,95.25 50.16,97
C2ON  (via drill 0.33)
  Top 0.254: v41.43,48.9 41.75,49.21 41.75,51.59 v41.59,51.75 | v49.53,33.81 49.53,34.77 53.34,38.58 53.34,49.37 v53.02,49.69 | v49.37,31.59 49.37,20.8 52.39,17.78 52.39,10 51.91,9.53 49.85,9.53 48.1,7.78 48.1,6.99 | R32.1 48.1,6.99 | Q9.4 46.99,1.27 47.94,2.22 47.94,6.83 48.1,6.99
  Bottom 0.254: U8.B3 31.11,53.34 34.29,53.34 35.56,52.07 35.88,52.07 37.47,53.66 40.01,53.66 41.59,52.07 v41.59,51.75 | v53.02,49.69 52.7,50.01 50.01,50.01 49.05,49.05 48.74,49.05 47.78,48.1 42.23,48.1 v41.43,48.9 | v49.53,33.81 49.53,31.75 v49.37,31.59
C2R  (via drill 0.33)
  Top 0.254: R49.2 v67.63,3.02 R48.1 | v67.79,6.19 67.79,11.43 68.74,12.38 68.74,23.02 67.47,24.29 v66.04,24.29
  Bottom 0.254: U8.A0 44.93,35.24 48.1,32.07 48.1,31.27 48.9,30.48 50.16,30.48 56.36,24.29 v66.04,24.29 | v67.63,3.02 67.79,3.17 v67.79,6.19
C2TH  (via drill 0.33)
  Top 0.203: 59.82,43.83 58.75,43.83 58.58,43.66 57.63,43.66 57.47,43.81 57.15,43.81
  Top 0.254: 59.82,43.83 R58.1 | 57.15,43.81 55.24,43.81 53.98,42.55 53.98,40.64 v54.45,40.16 | v52.55,39.05 51.13,39.05 | R54.1 51.13,39.05 | 51.13,39.05 C38.1
  Bottom 0.254: v54.45,40.16 53.18,40.16 52.7,39.69 52.7,39.21 v52.55,39.05 51.12,39.05 45.88,44.29 U8.A2
C2V
  Top 0.254: U8.A6 46.99,54.45 48.9,54.45 49.53,53.82 R59.2 | C40.1 46.99,54.47
  Top 0.406: 46.99,54.47 46.99,54.45
C2V_OA
  Top 0.254: U12.4 49.83,45.95 R56.2 49.69,46.67 48.9,47.47 48.9,49.05 49.36,49.52 R59.1
CVNGATE
  Top 0.254: U7.4 24.13,76.74 24.13,77.31 24.43,77.61 26.97,77.61 27.15,77.79 C24.2 27.16,77.79 27.62,77.79 28.26,78.42 28.26,79.38 | R40.2 27.61,80.03 28.26,79.38 | R42.1 30.62,80.63 29.37,79.38 28.26,79.38
CVOAREF
  Top 0.254: R36.2 23.83,73.98 C19.1 R37.2 22.54,77.61 R39.1 23.48,77.77 23.97,78.26 U7.3
CVOASNS  (via drill 0.33)
  Top 0.254: R29.1 25.87,80.15 U7.1 v25.88,78.26 | R28.2 24.45,75.09 24.92,75.56 v24.92,76.04
  Bottom 0.254: v24.92,76.04 24.92,77.31 v25.88,78.26
DI  (via drill 0.33)
  Top 0.254: U8.B13 29.05,74.77 27.62,73.34 27.62,71.6 v28.26,70.96 | v11.27,24.29 11.27,48.42 11.75,48.9 16.51,48.9 17.94,50.32 17.94,66.83 20,68.9 v27.15,68.9 | Q1.1 v26.19,19.84
  Bottom 0.254: v27.15,68.9 27.94,69.69 27.94,70.64 v28.26,70.96 | v11.27,24.29 16.19,24.29 20.16,20.32 25.72,20.32 v26.19,19.84
DI1
  Top 0.254: LED1.4-DIN 24.25,15.94 Q1.3 25.35,16.94 26.04,17.62 27.61,17.62 R1.2
DI2
  Top 0.254: LED1.2-DOUT 26.92,11.04 27.3,11.43 30.96,11.43 31.59,12.06 31.59,16.35 31.75,16.51 31.75,18.89 33.02,20.16 45.56,20.16 47.72,18 LED2.4-DIN
EN5V
  Top 0.254: U4.4 39.84,87.14 R21.1
FANON  (via drill 0.33)
  Top 0.254: v31.91,43.34 32.54,43.97 v34.45,43.97 | v34.29,50.16 34.29,47.47 v34.77,46.99 | v27.78,7.46 27.94,7.3 30.16,7.3 30.18,7.29 R41.2 31.58,7.29 31.91,7.62 33.34,7.62 33.66,7.94 33.66,8.26 33.65,8.26 Q6.1
  Bottom 0.254: U8.B4 30.96,49.37 31.27,49.05 33.18,49.05 v34.29,50.16 | v27.78,7.46 27.78,16.35 29.21,17.78 29.21,27.3 27.94,28.57 27.94,34.61 28.73,35.4 30.8,35.4 31.27,35.88 31.27,41.91 31.59,42.23 31.59,43.02 v31.91,43.34 | v34.45,43.97 34.45,44.29 35.24,45.09 35.24,46.51 v34.77,46.99
FB5V
  Top 0.254: 40.5,82.25 40.5,82.92 U4.3 | R22.1 40.48,82.23 40.5,82.25 | R23.2 40.5,82.25
GND  (via drill 0.33)
  Top 0.203: 17.14,45.09 16.99,45.24 16.03,45.24 15.89,45.1 R20.2 | R58.2 58.72,45.1 58.58,45.24 57.63,45.24 57.47,45.09 56.99,45.09
  Top 0.254: 17.77,45.1 17.78,45.09 17.14,45.09 | C14.2 36.77,87.73 36.99,87.95 | U3.2 5.87,92.71 v5.56,92.39 | U7.2 24.92,79.84 R29.2
  Top 0.406: U4.2 38.89,82.53 R23.1
  Top 0.61: 33.02,87.15 33.02,86.36 v32.07,86.2
  Bottom 0.406: Q8.3 41.91,89.53 41.91,90.01 | 30.48,89.53 32.54,89.53 | 30.48,90.81 32.54,90.81 | T1.1 35.4,70.17
  other vias: 65.72,97.47 66.04,94.3 14.29,79.38 12.54,79.38 5.08,90.01 3.65,90.81 0.95,93.66 3.33,93.66 3.65,85.09 4.6,84.77 3.65,77.63 5.56,81.12 21.91,45.24 20.8,44.29 18.73,44.61 18.41,42.23 12.06,38.42 12.06,34.61 12.06,30.8 12.06,25.72 12.22,9.68 26.35,5.56 26.35,8.1 24.29,9.68 27.15,8.1 25.88,11.43 18.26,11.11 18.1,13.97 15.24,10.48 6.03,0.79 5.08,6.35 7.14,5.87 1.59,6.67 9.84,11.27 10.48,26.99 10.48,31.75 10.48,35.56 16.83,40.64 17.46,48.58 9.84,43.81 19.05,41.27 13.65,36.2 13.65,32.38 13.65,27.3 16.19,99.22 53.98,96.52 58.1,98.42 55.56,93.98 57.31,93.82 64.61,97.63 54.93,82.07 42.7,82.07 36.51,78.74 41.27,80.64 43.81,70.8 46.67,80.33 8.89,91.28 6.19,95.57 61.75,97.63 59.37,96.68 61.44,96.52 59.85,99.06 63.18,98.9 65.41,99.06 66.67,96.52 68.1,99.22 72.87,93.5 68.9,86.52 72.23,91.6 71.91,88.11 70.17,85.57 67.94,87.63 61.75,77.95 61.91,79.38 59.85,79.38 52.23,81.12 55.4,80.17 55.24,75.41 58.26,77.63 57.15,74.77 48.9,74.77 66.04,75.25 53.82,74.3 61.28,65.88 61.28,63.34 12.22,47.94 10.48,50.48 12.38,53.02 10.48,55.88 12.06,56.36 12.22,58.26 10.64,58.42 12.38,62.07 10,63.02 10.16,66.2 8.73,70.96 16.35,60.01 19.21,61.91 21.75,58.74 24.29,60.01 19.21,56.2 20.48,54.45 23.02,53.82 31.43,55.09 34.92,55.09 34.92,53.82 31.43,52.23 27.78,52.39 22.86,49.37 27.94,49.05 26.35,47.62 22.07,46.99 26.51,49.37 19.84,50.64 17.14,51.91 22.86,51.91 34.45,51.59 39.69,52.39 40.16,48.1 35.88,47.78 33.66,47.15 34.61,45.72 35.4,43.81 42.86,43.34 37.31,45.88 43.02,55.24 7.78,73.98 3.97,74.77 10.16,73.82 6.03,71.44 6.03,67.79 6.03,63.98 7.62,60.33 10.48,60.01 8.1,56.36 7.62,53.02 9.84,53.18 14.61,51.28 15.4,53.66 16.51,56.04 15.88,58.26 19.05,59.05 21.11,62.39 16.67,62.55 15.72,49.69 19.21,46.83 6.51,48.58 12.38,76.2 15.4,76.36 20,75.56 21.11,79.38 16.51,78.11 10.32,99.06 13.18,99.06 65.72,90.96 70.33,77.15 70.48,73.66 68.9,76.36 68.9,71.44 70.33,67.47 68.9,66.36 64.93,70.96 59.05,66.36 61.59,75.09 50.16,76.99 55.24,76.99 53.02,70.01 57.15,69.85 57.15,66.52 53.66,68.1 50.16,68.26 47.47,69.22 46.04,70.96 46.04,68.58 50.96,69.69 43.81,68.58 36.35,63.34 43.66,65.41 30.8,61.12 31.27,57.31 34.45,56.52 38.1,59.05 37.31,55.4 43.18,58.9 41.91,62.23 49.53,63.5 46.04,56.04 53.5,51.44 51.91,53.18 55.88,52.39 56.04,59.69 55.88,56.67 48.1,57.78 49.21,60.8 34.92,40.01 31.91,41.12 28.57,40.48 21.43,38.89 41.91,41.91 43.18,38.26 38.89,39.37 50.16,37.31 48.42,38.58 47.62,40.16 55.88,47.78 62.07,52.55 64.61,50.96 62.23,51.12 59.53,51.12 55.4,49.21 63.98,46.99 66.83,48.74 67.79,49.85 65.88,51.91 68.42,45.56 64.14,43.81 54.77,41.59 52.07,38.26 53.34,37.31 52.07,35.88 54.13,32.07 52.23,30.48 57.78,63.02 56.52,63.66 53.02,65.72 54.77,63.18 54.45,61.59 57.31,61.59 58.1,56.99 63.18,61.28 62.39,54.61 59.21,54.61 60.01,61.28 62.87,68.58 67.15,64.14 69.53,63.82 64.14,55.72 68.42,40.48 68.26,35.72 68.26,29.05 70.01,20.48 69.53,14.13 63.98,36.2 63.98,31.75 63.82,25.4 62.55,35.88 62.55,28.57 57.78,40.48 57.78,28.42 60.96,25.24 51.59,14.13 47.31,12.86 47.15,28.42 50.96,24.45 43.02,35.24 35.88,34.29 34.13,30.8 40.16,25.08 41.27,21.11 45.88,16.51 40.64,16.51 43.66,7.78 60.96,9.84 62.23,9.84 64.45,9.84 58.58,10 66.67,9.53 68.74,5.4 68.58,10.32 58.9,6.19 68.58,0.79 47.62,9.53 40.32,4.29 38.1,5.71 34.92,7.3 30.8,8.73 21.11,11.43 26.19,13.65 23.18,19.21 22.38,21.27 31.91,24.13 30,19.68 37.31,23.81 34.13,23.18 28.42,21.27 26.19,20.8 25.08,22.07 22.38,24.45 21.75,27.62 19.21,23.18 19.37,27.46 28.42,26.99 27.78,24.29 24.92,26.19 22.07,30 23.97,33.18 24.13,29.69 23.34,36.04 21.27,33.02 21.43,36.67 19.53,31.75 19.37,36.51 25.72,41.91 4.92,94.46 6.51,43.81 6.51,39.21 6.51,33.5 6.51,27.78 32.54,27.46 35.08,36.51 31.27,25.72 52.7,26.04 43.97,13.65 50.01,17.46 48.42,17.3 48.42,20.8 46.2,21.27 43.5,23.65 42.07,29.21 47.31,31.75 53.98,39.37 52.55,48.58 65.09,39.37 66.36,38.42 67.31,39.37 17.62,67.63 14.92,71.12 21.75,67.63 26.51,69.69 27.78,64.14 28.57,61.12 37.31,13.97 35.24,16.67 41.43,8.41 45.72,11.75 42.39,17.94 30.8,16.51 30.48,14.76 31.59,11.11 36.83,90.81 41.59,94.93 37.62,95.57 34.45,91.6 33.66,98.58 35.08,90.65 28.89,93.98 34.92,97.79 31.91,89.53 34.45,89.38 35.4,86.84 27.78,99.06 44.61,83.34 48.74,87.63 53.34,10 46.51,41.43 42.39,60.33 40.48,70.48 41.91,75.25 39.53,76.83 50.32,71.75 4.29,81.76 15.88,79.69 15.88,81.28 15.72,87.63 15.88,83.19 14.61,88.9 18.41,83.19 20.16,78.42 23.18,71.75 18.89,77.63 23.18,99.22 21.27,93.98 20.32,91.28 23.34,95.89 19.21,99.22 18.26,99.22 29.21,87.31 28.42,89.06 24.45,85.72 21.91,82.55 23.02,83.82 25.08,83.03 27.94,85.09 24.45,84.14 27.62,82.87 27.78,84.14 29.21,83.82 28.57,84.45 28.26,83.34 29.21,88.9 31.75,84.77 17.94,86.68 36.67,89.22 37.94,90.96 38.73,90.96 39.37,91.44 40.32,91.44 36.2,80.17 35.24,80.33 33.97,80.49 28.26,76.36 34.13,82.07 30.8,76.04 31.11,79.53 30.16,79.22 30.48,82.07 12.86,91.44 16.51,94.3 16.51,95.89 16.51,92.71 23.34,87.95 17.94,96.68 13.02,96.68 9.05,95.57 8.26,97.63 6.03,99.22 18.26,78.74 20.64,74.14 17.3,80.17 21.43,72.23 24.77,73.03 18.57,76.04 17.14,75.88 16.99,73.34 7.78,76.36 9.21,78.26 8.73,65.56 10,79.38 12.7,73.82 5.87,76.2 5.24,78.9 5.24,77.15 3.02,76.2 3.33,78.9 2.38,80.33 1.11,81.76 2.06,85.25 0.79,85.25 0.79,88.42 15.08,65.88 55.09,13.02 72.07,78.58 31.43,99.06 31.91,98.11 28.89,94.93 26.99,94.77 32.86,96.04 35.88,97 33.66,97 32.23,94.77 30.8,86.04 29.05,88.11 15.72,6.35 29.37,2.7 33.18,2.54 17.46,6.19 32.38,5.56 19.05,5.56 29.37,4.29 29.37,1.91 29.37,3.49 13.34,11.11 9.68,9.53 19.37,7.94 17.78,8.26 15.72,8.26 42.23,88.74 44.13,87.63 45.09,88.74 42.23,87.95 42.86,87.47 43.66,86.36 43.97,85.09 46.2,85.57 46.2,87 48.26,85.57 47.62,86.04 44.61,86.36 50.16,84.77 47.31,84.77 47.94,83.34 45.88,84.3 45.09,82.07 46.2,83.03 46.83,87.63 42.23,91.44 47.94,90.96 48.58,91.36 47.31,91.36 46.67,90.96 45.96,91.36 46.67,94.46 47.47,93.98 42.7,94.14 42.7,95.41 41.43,96.2 41.43,98.11 51.44,99.06 32.86,90.17 32.86,91.6 31.91,91.44 30.48,90.96 29.53,90.49 25.88,91.76 26.67,91.76 27.46,91.76 58.1,95.25 61.75,91.44 55.24,98.27 67.94,97 66.83,90.96 51.44,85.57 57.94,34.45 57.78,85.57 54.45,84.61 58.9,83.03 58.74,82.07 63.98,73.03 60.8,69.85 43.34,78.26 44.61,80.64 49.53,80.33 22.7,69.85 48.1,79.06 46.99,76.68 49.85,77.79 63.5,63.02 66.52,57.63 48.1,61.91 66.2,63.02 63.5,65.56 68.42,74.3 66.99,68.1 43.81,63.34 64.93,59.85 65.56,61.59 69.06,60.17 63.34,57.63 67.79,61.91 70.64,61.91 60.96,57.94 70.33,26.04 70.48,22.23 71.91,24.92 73.18,23.65 73.18,25.4 71.75,26.67 70.8,27.94 72.87,20.48 68.9,30.48 56.67,5.71 57.47,6.51 54.13,3.81 58.58,8.89 57.31,8.89 56.83,7.46 59.85,9.84 70.01,12.54 71.44,14.13 71.6,20.16 73.66,13.49 73.5,11.91 72.23,10.79 70.96,9.84 69.06,9.05 54.13,14.45 54.13,16.19 55.24,18.73 52.86,21.43 55.56,20.8 55.56,23.18 54.29,24.77 50.8,28.57 46.51,39.21 49.85,44.45 45.88,37.94 48.74,42.55 46.67,44.45 46.51,36.51 52.23,41.59 52.23,40.32 49.53,36.83 54.61,37.94 61.44,48.9 63.34,48.26 64.61,53.34 71.6,54.61 69.37,54.45 72.55,60.48 73.18,70.64 73.18,65.56 73.18,75.72 71.91,85.41 73.66,86.52 73.5,88.74 73.18,90.65 68.74,87.79 67.47,93.03 35.4,76.99 32.23,65.88 30.64,68.42 30.64,65.88 48.58,53.34 46.51,53.18 43.34,46.51 41.75,44.61 48.74,46.67 52.07,56.2 23.34,58.26 24.92,57.78 25.08,55.56 32.07,37.47 29.37,1.11 21.11,0.95 4.29,17.94 5.08,24.45 5.4,11.59 17.14,36.51 12.54,68.42 14.61,73.18 18.73,73.18 18.73,71.44 24.61,69.69 25.56,71.44 32.86,0.95 39.05,6.99 28.57,18.26 37.31,11.43 54.93,11.75 46.35,34.92 38.42,36.51 33.66,41.12 38.73,43.34 27.15,54.93 25.56,62.87 22.7,64.61 24.61,68.1 73.18,15.08 73.03,18.89 67.47,26.19 53.34,54.77 58.42,49.53 57.31,47.94 52.7,44.45 35.08,67.63 46.35,46.51 46.35,49.85 41.91,46.99 20.8,9.37 67.79,78.58 7.14,87.95 27.15,71.12 19.84,82.55 32.86,83.66 35.72,89.85 33.66,88.58 34.29,87.31 33.66,86.52 35.56,87.95 35.56,88.9 36.04,91.12 21.11,87.95 37.31,98.42 42.7,97 42.55,98.42 18.1,4.29 23.65,6.99 18.1,0.95 55.88,4.45 53.66,5.56 56.52,0.95 56.36,86.68 32.54,76.36 32.54,71.28 38.58,33.66 42.55,31.91 33.81,26.04 36.2,21.27 45.09,26.83 46.2,23.5 48.26,23.81 33.02,59.69 27.15,59.05 27.46,50.64 42.55,48.9 52.39,58.74 50.48,65.41 48.1,65.25 39.69,68.74 40.32,64.45 55.72,2.54 21.11,5.56 7.94,78.42 11.43,71.28 10.32,69.37 55.88,25.88 53.5,0.95 58.1,7.3 39.69,80.96 30.64,73.5 36.99,81.12 28.26,72.87 27.15,74.14 33.5,82.55 33.66,83.34 33.81,85.25 39.21,84.93 40.8,84.3 41.91,81.28 41.75,80.01 42.7,82.87 42.55,83.66 40.48,97.16 41.27,94.14 40.16,98.74 38.73,98.11 35.24,4.29 42.23,53.82 53.18,7.94 54.77,7.3 55.56,10.32 7.46,91.12 70.48,83.98 56.36,45.56 23.34,74.93 21.91,75.88 23.34,80.17 21.75,77.79 50.96,12.86 50.01,10.16 49.53,8.1 53.5,12.86 47.31,7.78 47.15,5.08 46.99,2.38 48.1,1.27 45.24,2.22 45.24,3.02 45.24,3.97 45.4,5.24 46.51,3.97 42.39,5.56 42.23,4.45 42.23,3.33 42.23,2.22 35.72,57.94 33.97,57.78 32.23,58.58 37.62,84.77 40.96,86.68 16.83,7.46 19.21,74.45 45.4,93.98 45.4,98.27 46.99,98.27 48.58,98.27 60.8,95.09 61.75,93.66 61.28,88.9 60.01,88.9 58.9,87.79 56.36,90.81 53.34,92.71 53.02,87.79 44.13,50.64 33.02,61.12 33.66,62.87 31.59,63.18 37.62,67.79 28.26,68.42 30.64,70.96 22.7,56.04 24.13,45.56 24.13,43.34 21.91,43.34 27.62,43.97 25.72,38.26 28.73,37.94 30.64,37.94 30.48,40.48 31.43,35.08 28.26,35.88 26.99,32.86 26.04,27.94 17.62,24.13 17.46,21.75 20.8,19.53 22.38,14.13 28.73,16.03 28.57,12.7 28.57,8.41 45.09,19.21 52.39,19.37 50.48,45.72 50.48,43.34 52.07,46.83 50.32,51.75 48.42,50.16 48.58,34.29 57.15,50.96
  pour Top: 0,99.85 74.61,99.85 74.61,0 0,0
  pour Bottom: 0,0 74.61,0 74.61,100.01 0,100.01
HSTH  (via drill 0.33)
  Top 0.254: C27.1 R44.1 T1.2 | U6.1 41.74,77.78 v41.27,77.31
  Bottom 0.254: T1.2 41.27,72.23 v41.27,77.31
IN-1  (via drill 0.33)
  Top 0.254: U3.5 9.53,92.71 10.48,91.76 11.11,91.76 11.43,92.08 R12.1 11.43,93.03 | C10.1 11.43,95.41 | 11.43,95.41 v11.43,95.73 | 12.38,95.41 11.43,95.41
  Top 1.422: C10.1 R12.1
  Top 1.676: 12.38,95.41 11.43,95.41 10.48,95.41
  Bottom 0.254: v10.64,95.89 10.64,95.41 v10.95,95.09 10.95,95.25 10.79,95.41 | v12.7,95.25 12.54,95.25 12.38,95.41 | 11.91,95.25 v11.43,95.73 | v11.91,95.09 11.91,95.25 | 11.91,95.25 12.06,95.41 | v11.91,95.09 11.75,95.09 | v10.16,95.25 10.32,95.25 10.48,95.41 11.43,95.41 11.75,95.09 | 11.75,95.09 11.91,95.25 | v12.22,95.89 12.06,95.89 12.06,95.41 | 12.06,95.41 12.06,95.25 v11.91,95.09 | 12.22,95.41 11.91,95.41
  Bottom 1.676: 11.43,95.41 11.43,91.28 9.53,89.38 L1.P$2 6.51,89.38 5.71,88.58 4.45,88.58 3.81,89.22 C9.+ | 11.43,95.41 10.79,95.41 10.48,95.41 | 11.43,95.41 11.91,95.41 12.06,95.41 12.22,95.41 12.38,95.41
IN-2  (via drill 0.33)
  Top 0.254: U11.5 66.04,92.39 65.72,92.71 65.09,92.71 64.14,91.76 63.34,91.76 63.18,91.92 R50.1 63.21,92.89 63.21,93.66 | v63.18,95.41 63.82,95.41 64.14,95.09 | v62.71,94.77 63.15,94.77 C36.1 63.21,94.77 v63.66,94.77
  Top 1.422: C36.1 63.21,93.66
  Top 1.676: 64.14,95.09 62.23,95.09
  Bottom 0.254: 63.18,95.09 63.34,95.09 v63.66,94.77 63.98,95.09 63.98,95.41 | v63.98,95.57 63.98,95.41 | 63.98,95.41 v64.45,94.93 | v62.39,95.57 62.39,95.41 62.23,95.25 62.23,95.41 | v61.91,94.93 62.07,94.93 62.23,95.09 62.71,95.09 | 62.23,95.57 62.23,95.41 | 62.23,95.41 v62.39,95.57 | v62.39,95.57 62.39,95.09 v62.71,94.77 | 63.18,94.61 62.71,95.09 | 62.71,95.09 62.87,95.09 v63.18,95.41
  Bottom 1.676: C35.+ L3.P$2 64.77,89.38 63.18,90.96 63.18,94.61 63.18,95.09 | 62.23,95.09 62.39,95.09 62.71,95.09 63.18,95.09 | 63.18,95.09 64.14,95.09
IS1O
  Top 0.254: U3.6 9.05,94.44 R9.1
IS1O1
  Top 0.254: U11.6 67.47,91.91 67.94,92.08 67.8,92.09 R47.1
ISNS_REF  (via drill 0.33)
  Top 0.254: R2.2 37.29,47.31 R3.1 37.78,47.47 37.78,46.51 38.1,46.2 39.69,46.2 40.8,47.62 42.23,47.62 43.34,48.74 43.34,51.28 43.66,51.59 43.66,51.91 | U3.1 5.71,93.36 | 5.71,93.36 4.78,93.36 4.45,93.03 4.45,92.08 | 4.45,92.08 4.45,88.27 5.4,87.31 5.4,81.92 4.45,80.96 4.45,75.56 7.62,72.39 7.62,62.23 v8.89,60.96 | C33.1 68.28,94 68.1,93.82 66.99,93.82 66.67,93.5 U11.1 | C33.1 68.26,94.61 | v44.13,60.8 48.26,60.8 49.69,62.23 v50.48,62.23 | C33.1 68.74,94.61 69.37,93.98 69.37,90.81 | C26.1 U8.A5 43.66,51.91 | 43.66,51.91 43.66,53.34 40.96,56.04 40.96,56.99 v41.59,57.63 | TP5.1 4.29,92.23 4.45,92.08 | 69.37,90.81 69.37,88.9 69.53,88.74 69.53,81.76 69.06,81.28 69.06,79.69 v69.37,79.38 | TP7.1 69.37,90.81 | C5.1 5.71,93.36
  Bottom 0.254: v8.89,60.96 21.59,60.96 24.13,58.42 31.43,58.42 32.7,57.15 36.35,57.15 36.83,57.63 40.32,57.63 40.96,58.26 | v69.37,79.38 69.53,79.22 69.53,64.77 66.99,62.23 v50.48,62.23 | 40.96,58.26 41.91,59.21 42.55,59.21 v44.13,60.8 | v41.59,57.63 40.96,58.26
N$2
  Top 1.27: 51.75,3.81 51.75,5.08 Q9.8 49.62,1.43 51.91,1.43 51.91,1.27 Q9.5 | 51.75,3.81 51.75,3.02 F3.A 51.79,2.54 Q9.6 | Q9.7 51.75,3.81
N$3
  Top 0.254: U5.1 23.48,45.95 R19.2 23.65,46.67 24.13,47.15 24.13,47.47 24.61,47.94 R15.2
N$4
  Top 0.254: R18.1 23.48,42.95 U5.3 | R18.1 23.48,42.53 23.5,42.55 | R14.2 24.45,40.96 24.13,41.27 24.13,41.75 23.65,42.23 R18.1
N$6
  Top 0.254: LED2.2-DOUT 51.02,11.84 48.74,14.13 44.93,14.13 41.27,17.78 JP3.1
N$10
  Top 1.422: Q5.2 26.35,86.17 F2.A
N$13
  Bottom 1.27: 37.79,96.99 38.27,96.99 39.77,95.49 39.77,95.01
  Bottom 1.422: J1.2 39.77,95.01 | R6.1 37.79,96.99
N$16
  Top 0.254: U12.1 51.13,42.95 R57.2 50.96,42.23 50.48,41.75 50.48,41.43 50.01,40.96 R53.2
N$17
  Top 0.254: R52.2 50.01,47.94 50.48,47.47 50.48,46.99 50.8,46.67 R56.1 51.13,45.95 U12.3
N$26
  Top 0.254: R38.2 U8.A12
N$32
  Top 1.27: Q4.7 23.3,2.54 F1.A 22.83,3.81 Q4.6 | 22.86,1.27 Q4.8 Q4.6 | 22.86,5.08 Q4.5 Q4.6
N$34
  Top 0.61: Q6.3 33.23,6.14 33.34,6.03 33.34,4.29 34.92,2.7 J3.2
NGATE1  (via drill 0.33)
  Top 0.406: v32.7,88.11 32.7,88.9 33.66,89.85 33.66,93.19 33.02,93.82 31.75,93.82 31.27,94.3 31.27,95.73 30.7,96.3 U1.5 28.57,96.52 28.59,96.53 R4.1
  Bottom 0.406: Q3.4 32.23,87 32.7,87.47 v32.7,88.11
NGATE2  (via drill 0.33)
  Top 0.254: R45.1 44.13,89.69
  Top 0.406: R45.1 44.44,89.71 v45.08,90.33 v45.09,90.33
  Top 0.61: U10.5 49.85,93.5 v50.01,93.34
  Bottom 0.406: v45.08,90.33 45.08,90.8 45.09,90.81
  Bottom 0.61: Q8.4 45.09,90.81 45.09,91.92 45.4,92.23 48.9,92.23 v50.01,93.34
OA1+  (via drill 0.33)
  Top 0.254: R15.1 18.89,47.94 v18.41,48.42 | v2.38,81.92 2.38,83.81 R17.1
  Bottom 0.254: v18.41,48.42 18.41,55.24 | 18.41,55.24 18.41,56.83 16.19,59.05 7.46,59.05 6.83,59.69 6.83,78.58 4.29,81.12 3.17,81.12 v2.38,81.92 | J2.2 18.43,55.23 18.41,55.24
OA1-  (via drill 0.33)
  Top 0.254: R14.1 v20,40.96 18.41,39.37 18.41,23.02 22.23,19.21 22.23,15.24 20.32,13.34 20.32,10.79 20.95,10.16 21.59,10.16 22.54,9.21 R13.1
  Bottom 0.254: J2.1 24.13,53.5 23.5,52.86 22.54,52.86 20.8,51.12 20.8,45.72 20,44.93 v20,40.96
OA2+  (via drill 0.33)
  Top 0.254: 56.75,54.37 56.52,54.13 56.52,47.15 54.29,44.93 v54.29,44.13 | 56.75,54.37 59.21,56.83 66.83,56.83 71.6,61.59 71.6,77.79 71.28,78.11 68.74,78.11 68.42,78.42 68.42,78.9 68.1,79.22 R55.1 | R53.1 v51.59,40.96 | J4.2 52.54,55.23 52.86,55.56 55.56,55.56 56.75,54.37
  Bottom 0.254: v51.59,40.96 53.02,40.96 53.98,41.91 53.98,43.81 v54.29,44.13
OA2-  (via drill 0.33)
  Top 0.254: v56.67,26.19 56.67,23.5 56.52,23.34 56.52,10.32 55.4,9.21 52.86,9.21 52.07,8.41 R51.1 | v51.91,47.94 R52.1 51.12,47.94 J4.1
  Bottom 0.254: v56.67,26.19 56.67,40.8 56.04,41.43 56.04,43.81 v51.91,47.94
PB5  (via drill 0.33)
  Top 0.254: v34.77,32.54 33.34,31.11 33.34,26.67 30.8,24.13 30.8,17.94 29.84,16.99 v29.84,15.88 | U8.B5 29.84,46.83 31.59,45.09 v37.78,45.09 | JP1.3 33.02,15.24 v32.7,15.56
  Top 0.305: U8.B5 R35.1
  Bottom 0.254: v34.77,32.54 35.88,33.66 36.83,33.66 37.62,34.45 37.62,44.93 v37.78,45.09 | v32.7,15.56 30.16,15.56 v29.84,15.88
PB12  (via drill 0.33)
  Top 0.254: U6.6 39.2,77.93 38.89,77.63 35.24,77.63 35.08,77.79 34.77,77.79 | v32.86,77.31 33.18,77.63 33.97,77.63 34.13,77.79 34.77,77.79 | R34.1 34.62,77.93 34.77,77.79
  Bottom 0.254: v32.86,77.31 33.18,77.63 33.18,78.74 32.86,79.06 31.91,79.06 30.16,77.31 U8.B12
PGATE1  (via drill 0.33)
  Top 0.61: U1.8 24.77,97.14 R5.2 24.75,97.93 24.92,98.11 v25.08,98.11
  Bottom 0.61: Q2.4 v25.08,98.11
PGATE2  (via drill 0.33)
  Top 0.254: R46.1 46.02,96.82 v45.96,96.76
  Top 0.406: 45.96,95.74 U10.8
  Top 0.61: v45.96,96.76 45.96,95.74
  Bottom 0.61: Q7.4 48.42,94.3 47.94,94.77 47.94,96.68 47.62,97 46.2,97 v45.96,96.76
Q7G
  Top 0.305: R40.1 Q5.1
S1
  Top 0.254: S1.1 S1.2 22.86,27.3 22.86,33.66 23.5,34.29 24.13,34.29 26.51,36.67 U8.B9
S2
  Top 0.254: S2.1 S2.2 47.62,26.67 48.26,27.3 48.26,29.84 46.51,31.59 U8.C13
SCL-TX
  Bottom 0.254: U8.B10 45.88,63.66 47.47,63.66 50.16,60.96 57.15,60.96 57.47,60.64 57.47,51.59 58.58,50.48 64.14,50.48 66.67,47.94 66.67,39.05 66.99,38.73 66.99,38.1 66.67,37.78 66.67,25.56 68.9,23.34 68.9,13.02 68.26,12.38 53.98,12.38 53.82,12.22 46.51,12.22 46.04,12.7 JP2.2
SDA-RX  (via drill 0.33)
  Top 0.254: v54.29,13.49 v54.29,10.32 | v53.5,63.66 53.5,58.42 v53.66,58.26 | v57.63,49.85 57.63,50.48 v58.9,51.75
  Bottom 0.254: v58.9,51.75 64.77,51.75 67.63,48.9 67.63,40.01 67.94,39.69 67.94,37.78 67.63,37.47 67.63,27.15 73.98,20.8 73.98,14.92 70.48,11.43 55.56,11.43 54.45,10.32 v54.29,10.32 | v54.29,13.49 46.83,13.49 45.09,15.24 JP2.3 | U8.B11 50.01,67.15 v53.5,63.66 | v53.66,58.26 53.66,56.04 53.98,55.72 53.98,53.18 57.31,49.85 v57.63,49.85
SW5V
  Top 0.254: C13.2 37.94,85.41 U4.6
  Top 0.61: L2.1 37.59,85.62 U4.6

## Text on the board
tPlace: J1 | C4 | R5 | R4 | R46 | C32 | C1A | U1 | R9 | C10 | C31 | C36 | C34 | C33 | C5 | C1 | U10 | REF | C16 | U3 | R12 | D1 | D3 | R50 | U11 | R47 | C2 | F2 | C3 | R8 | C29 | REF | C14 | R21 | R7 | C13 | R45 | C30 | D2 | + | L2 | + | R17 | U4 | R22 | C2A | R55 | C17 | R23 | C11 | R29 | R40 | R42 | R34 | U6 | R39 | C24 | C23 | R37 | R36 | C22 | C28 | C19 | R44 | R26 | T1 | C27 | R25 | R14 | C12 | R31 | R38 | RS+ | C37 | RS+ | C25 | C40 | C18 | C26 | R24 | R43 | U9 | RS- | RS- | R2 | R59 | R15 | R52 | R34 | R19 | R3 | R56 | U5 | R20 | C7 | C39 | U12 | R58 | R18 | R57 | R14 | R53 | NTC10k | NTC10k | R16 | R54 | U2 | C15 | 2V495 | C8 | C38 | R30 | C6 | C20 | R33 | C21 | S1 | S2 | Q1 | R1 | DO | B5 | RX | TX | 3V3 | LED1 | LED2 | 5V | GND | R13 | R41 | R32 | R51 | R12 | R27 | Q4 | Q6 | + | Q9 | R48 | R11 | R49 | F1 | F3
bPlace: 10A | GND | VB | Q2 | R6 | Q7 | C9 | Q3 | Q8 | C35 | L1 | L3 | rev0.net | justin kenny 2020
bStop: 7.5-12.6V | regenerative 18650 cycler | v2.4su